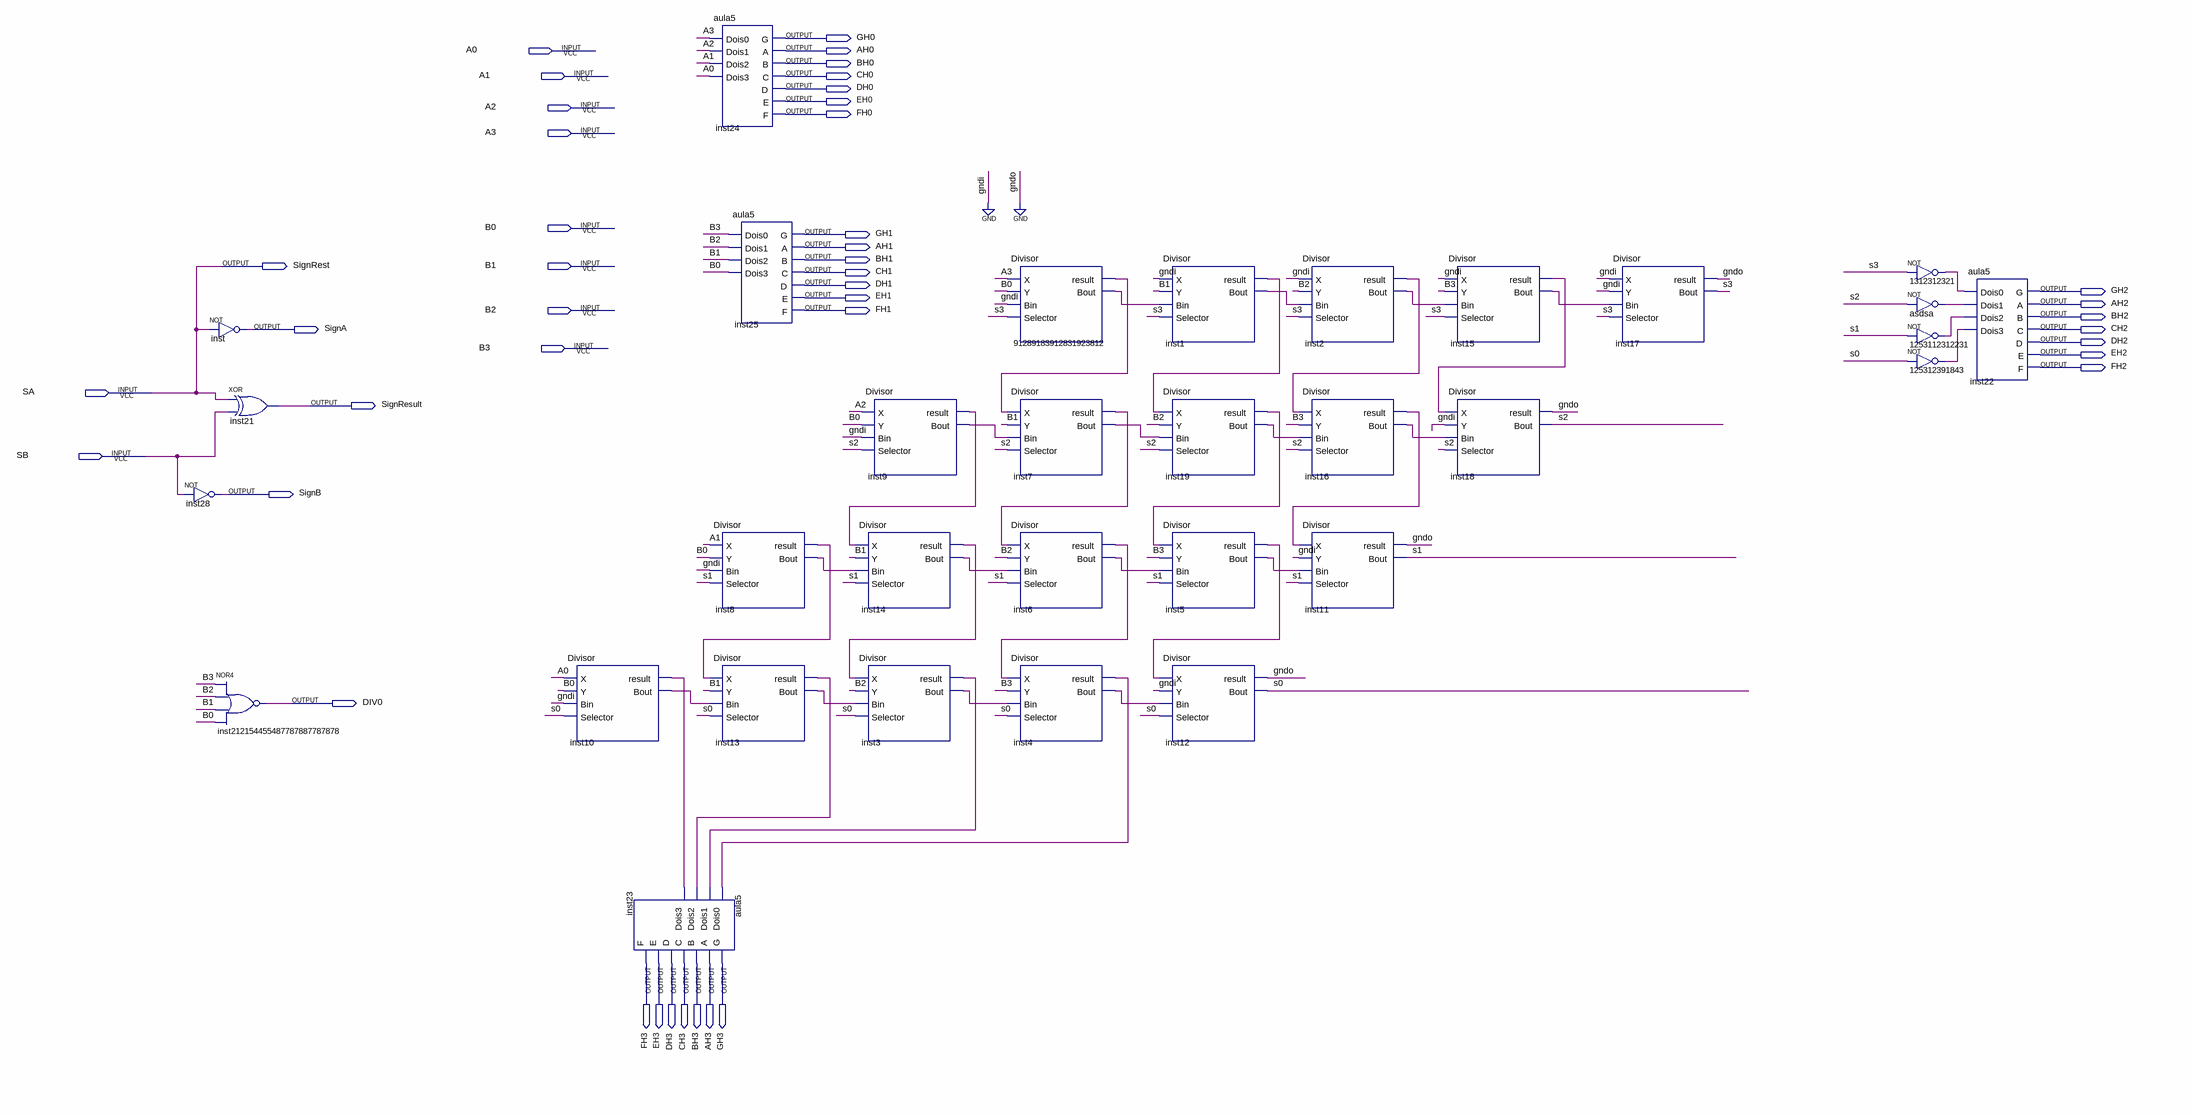
[diagram p0: schematic sheet]
// Quartus schematic aula11.bdf as structural Verilog: 32 symbols, 43 pins
module aula11 (
  input  A0,
  input  A1,
  input  A2,
  input  A3,
  input  B0,
  input  B1,
  input  B2,
  input  B3,
  input  SA,
  input  SB,
  output GH0,
  output AH0,
  output BH0,
  output CH0,
  output DH0,
  output EH0,
  output FH0,
  output GH1,
  output AH1,
  output BH1,
  output SignRest,
  output CH1,
  output DH1,
  output GH2,
  output EH1,
  output AH2,
  output FH1,
  output BH2,
  output SignA,
  output CH2,
  output DH2,
  output EH2,
  output FH2,
  output SignResult,
  output SignB,
  output DIV0,
  output FH3,
  output EH3,
  output DH3,
  output CH3,
  output BH3,
  output AH3,
  output GH3
);

  wire asdsa_out, gndo, inst1_bout, inst1_result, inst2_bout, inst2_result, inst3_bout, inst3_result,
       inst4_bout, inst4_result, inst5_bout, inst5_result, inst6_bout, inst6_result, inst7_bout,
       inst7_result, inst8_bout, inst8_result, inst9_bout, inst9_result, inst10_bout, inst10_result,
       inst13_bout, inst13_result, inst14_bout, inst14_result, inst15_bout, inst15_result, inst16_bout,
       inst16_result, inst19_bout, inst19_result, n1312312321_out, n125312391843_out, n1253112312231_out,
       n91289183912831923812_bout, n91289183912831923812_result, s0, s1, s2, s3;

  not inst (SignA, SA);
  not inst28 (SignB, SB);
  xor inst21 (SignResult, SA, SB);
  nor inst212154455487787887787878 (DIV0, B3, B2, B1, B0);
  Divisor inst10 (.X(A0), .Y(B0), .Bin(1'b0), .Selector(s0), .result(inst10_result), .Bout(inst10_bout));
  aula5 inst23 (
    .Dois0(inst4_result), .Dois1(inst3_result), .Dois2(inst13_result), .Dois3(inst10_result), .G(GH3),
    .A(AH3), .B(BH3), .C(CH3), .D(DH3), .E(EH3), .F(FH3));
  aula5 inst24 (
    .Dois0(A3), .Dois1(A2), .Dois2(A1), .Dois3(A0), .G(GH0), .A(AH0), .B(BH0), .C(CH0), .D(DH0), .E(EH0),
    .F(FH0));
  Divisor inst8 (.X(A1), .Y(B0), .Bin(1'b0), .Selector(s1), .result(inst8_result), .Bout(inst8_bout));
  Divisor inst13 (
    .X(inst8_result), .Y(B1), .Bin(inst10_bout), .Selector(s0), .result(inst13_result), .Bout(inst13_bout));
  aula5 inst25 (
    .Dois0(B3), .Dois1(B2), .Dois2(B1), .Dois3(B0), .G(GH1), .A(AH1), .B(BH1), .C(CH1), .D(DH1), .E(EH1),
    .F(FH1));
  Divisor inst9 (.X(A2), .Y(B0), .Bin(1'b0), .Selector(s2), .result(inst9_result), .Bout(inst9_bout));
  Divisor inst14 (
    .X(inst9_result), .Y(B1), .Bin(inst8_bout), .Selector(s1), .result(inst14_result), .Bout(inst14_bout));
  Divisor inst3 (.X(inst14_result), .Y(B2), .Bin(inst13_bout), .Selector(s0), .result(inst3_result), .Bout(inst3_bout));
  Divisor u_91289183912831923812 (
    .X(A3), .Y(B0), .Bin(1'b0), .Selector(s3), .result(n91289183912831923812_result),
    .Bout(n91289183912831923812_bout));
  Divisor inst7 (
    .X(n91289183912831923812_result), .Y(B1), .Bin(inst9_bout), .Selector(s2), .result(inst7_result),
    .Bout(inst7_bout));
  Divisor inst6 (.X(inst7_result), .Y(B2), .Bin(inst14_bout), .Selector(s1), .result(inst6_result), .Bout(inst6_bout));
  Divisor inst4 (.X(inst6_result), .Y(B3), .Bin(inst3_bout), .Selector(s0), .result(inst4_result), .Bout(inst4_bout));
  Divisor inst1 (
    .X(1'b0), .Y(B1), .Bin(n91289183912831923812_bout), .Selector(s3), .result(inst1_result),
    .Bout(inst1_bout));
  Divisor inst19 (
    .X(inst1_result), .Y(B2), .Bin(inst7_bout), .Selector(s2), .result(inst19_result), .Bout(inst19_bout));
  Divisor inst5 (.X(inst19_result), .Y(B3), .Bin(inst6_bout), .Selector(s1), .result(inst5_result), .Bout(inst5_bout));
  Divisor inst12 (.X(inst5_result), .Y(1'b0), .Bin(inst4_bout), .Selector(s0), .result(gndo), .Bout(s0));
  Divisor inst2 (.X(1'b0), .Y(B2), .Bin(inst1_bout), .Selector(s3), .result(inst2_result), .Bout(inst2_bout));
  Divisor inst16 (
    .X(inst2_result), .Y(B3), .Bin(inst19_bout), .Selector(s2), .result(inst16_result), .Bout(inst16_bout));
  Divisor inst11 (.X(inst16_result), .Y(1'b0), .Bin(inst5_bout), .Selector(s1), .result(gndo), .Bout(s1));
  Divisor inst15 (.X(1'b0), .Y(B3), .Bin(inst2_bout), .Selector(s3), .result(inst15_result), .Bout(inst15_bout));
  Divisor inst18 (.X(inst15_result), .Y(1'b0), .Bin(inst16_bout), .Selector(s2), .result(gndo), .Bout(s2));
  Divisor inst17 (.X(1'b0), .Y(1'b0), .Bin(inst15_bout), .Selector(s3), .result(gndo), .Bout(s3));
  not u_1312312321 (n1312312321_out, s3);
  not asdsa (asdsa_out, s2);
  not u_1253112312231 (n1253112312231_out, s1);
  not u_125312391843 (n125312391843_out, s0);
  aula5 inst22 (
    .Dois0(n1312312321_out), .Dois1(asdsa_out), .Dois2(n1253112312231_out), .Dois3(n125312391843_out),
    .G(GH2), .A(AH2), .B(BH2), .C(CH2), .D(DH2), .E(EH2), .F(FH2));

  assign SignRest = SA;
  // also tied to GND on the sheet: gndo
endmodule
